# Altium project SAM_Dispenser.PrjPcb
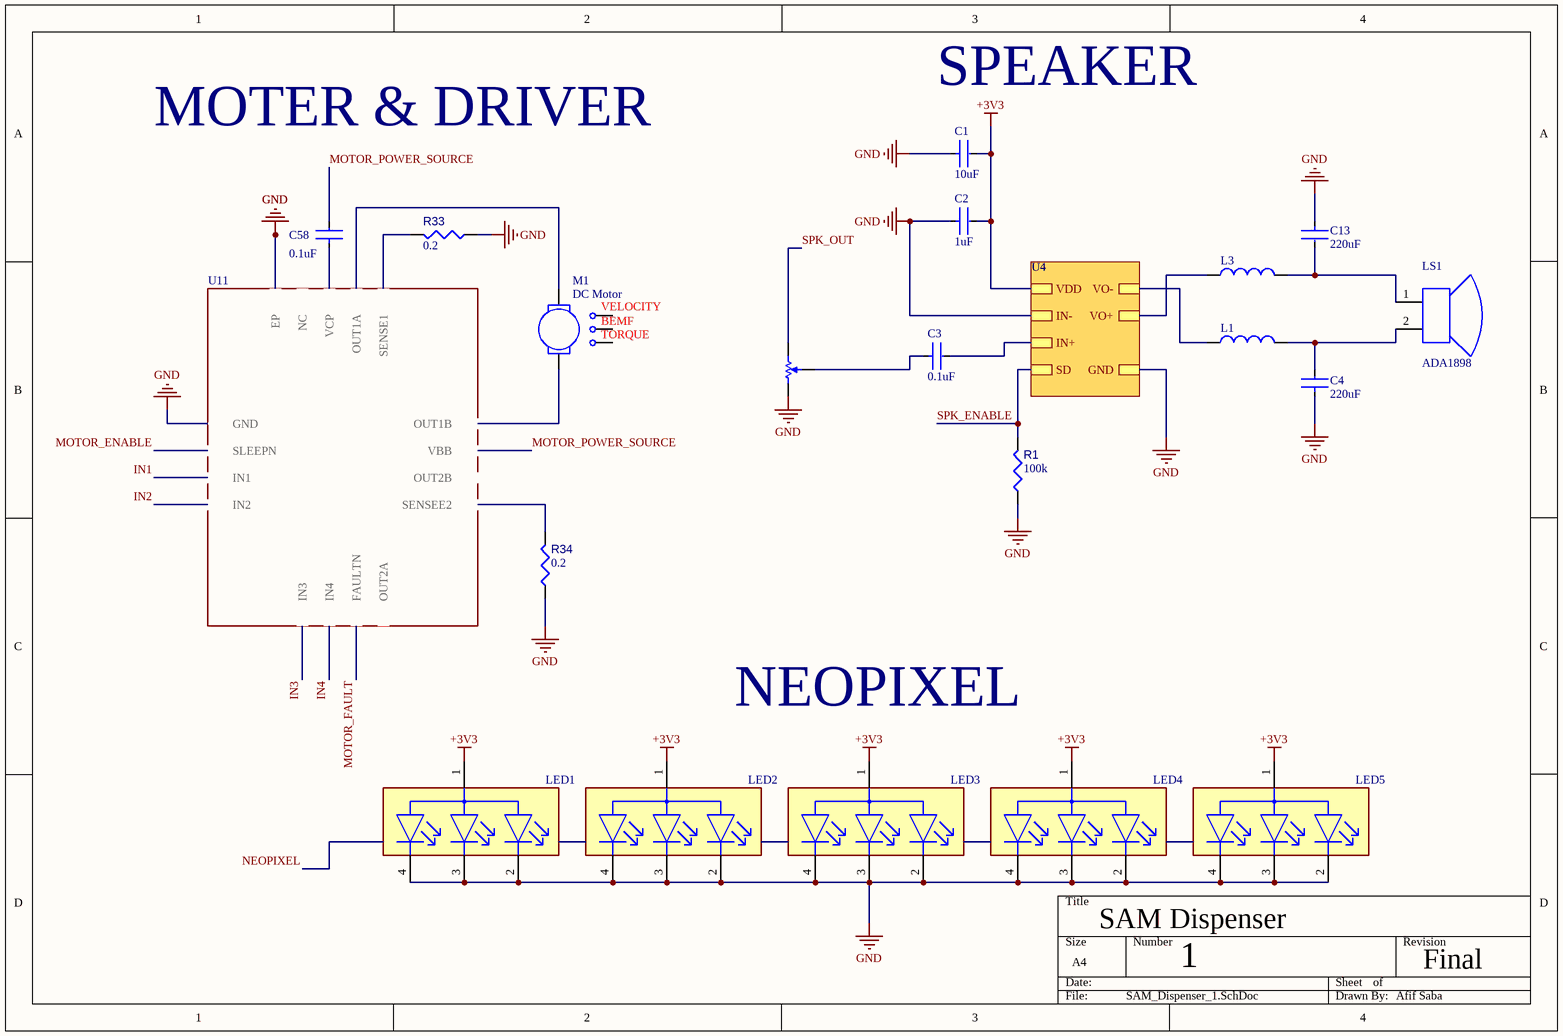
[diagram p0: SAM_Dispenser_1.SchDoc]
2 sheets, 30 parts. Net scope: hierarchical (ports join the sheet entries above them; power ports are global).
Sheets:
  SAM_Dispenser_1.SchDoc
  SAM_Dispenser_2.SchDoc

## Sheet SAM_Dispenser_1.SchDoc
size A4; SheetNumber: 1; SheetTotal: 2

### Parts
C1  Parameter 1: 10uF  [4.7uF400V]  (hidden comment: 475CKE400M)
C2  Parameter 1: 1uF  [4.7uF400V]  (hidden comment: 475CKE400M)
C3  Parameter 1: 0.1uF  [4.7uF400V]  (hidden comment: 475CKE400M)
C4  Parameter 1: 220uF  [4.7uF400V]  (hidden comment: 475CKE400M)
C13  Parameter 1: 220uF  [4.7uF400V]  (hidden comment: 475CKE400M)
C58  Parameter 1: 0.1uF  [4.7uF400V]  (hidden comment: 475CKE400M)
L1  Inductor47pH  [WE-PD 1050]  (value not drawn)
L3  Inductor47pH  [WE-PD 1050]  (value not drawn)
LED1  SML-LX0404SIUPGUSB  [FP-SML-LX0404SIUPGUSB-MFG]  (value not drawn)
LED2  SML-LX0404SIUPGUSB  [FP-SML-LX0404SIUPGUSB-MFG]  (value not drawn)
LED3  SML-LX0404SIUPGUSB  [FP-SML-LX0404SIUPGUSB-MFG]  (value not drawn)
LED4  SML-LX0404SIUPGUSB  [FP-SML-LX0404SIUPGUSB-MFG]  (value not drawn)
LED5  SML-LX0404SIUPGUSB  [FP-SML-LX0404SIUPGUSB-MFG]  (value not drawn)
LS1  ADA1898  [ADAI-ADA1898]
M1  DC Motor
R1  value 100k  [RESC0402(1005)_L]  (hidden comment: 3KR2F)
R2  TC33X-2-103E  [BOUR-TC33X-2_V]  (value not drawn)
R33  R34: 0.2  [RESC0402(1005)_L]  (hidden comment: 3KR2F)
R34  R34: 0.2  [RESC0402(1005)_L]  (hidden comment: 3KR2F)

### Sub-sheets
U11 = File Name (file not in this document): GND (bidir), SLEEPN, IN1, IN2, OUT1B, VBB, OUT2B, SENSEE2, IN3, IN4, FAULTN, OUT2A, EP, NC, VCP, OUT1A, SENSE1
? = U4 (file not in this document): VDD, VO-, VO+, IN-, IN+, SD, GND

### Nets
+3V3: C1.2 C2.2 LED1.1(Common_Anode) LED2.1(Common_Anode) LED3.1(Common_Anode) LED4.1(Common_Anode) LED5.1(Common_Anode) ; sheet /VDD
GND: C1.1 C2.1 C4.1 C13.1 LED1.2(Red_C) LED1.3(Blue_C) LED1.4(Green_C) LED2.2(Red_C) LED2.3(Blue_C) LED2.4(Green_C) LED3.2(Red_C) LED3.3(Blue_C) LED3.4(Green_C) LED4.2(Red_C) LED4.3(Blue_C) LED4.4(Green_C) LED5.2(Red_C) LED5.3(Blue_C) LED5.4(Green_C) R1.1 R2.1 R33.1 R34.1 ; sheet /IN-, sheet /GND, sheet U11/GND, sheet U11/EP
IN1: sheet U11/IN1
IN2: sheet U11/IN2
IN3: sheet U11/IN3
IN4: sheet U11/IN4
MOTOR_ENABLE: sheet U11/SLEEPN
MOTOR_FAULT: sheet U11/FAULTN
MOTOR_POWER_SOURCE: C58.2 ; sheet U11/VBB
SPK_ENABLE: R1.2 ; sheet /SD
SPK_OUT: R2.3
NetC3_1: C3.1 R2.2
NetC3_2: C3.2 ; sheet /IN+
NetC4_2: C4.2 L1.2 LS1.2(-)
NetC13_2: C13.2 L3.2 LS1.1(+)
NetC58_1: C58.1 ; sheet U11/VCP
NetL1_1: L1.1 ; sheet /VO-
NetL3_1: L3.1 ; sheet /VO+
NetM1_1: M1.1 ; sheet U11/OUT1A
NetM1_2: M1.2 ; sheet U11/OUT1B
NetR33_2: R33.2 ; sheet U11/SENSE1
NetR34_2: R34.2 ; sheet U11/SENSEE2

Not connected (* = marked no-connect by the designer): M1 3 4 5

### Notes on the sheet
- SPEAKER
- MOTER & DRIVER
- NEOPIXEL
- SAM Dispenser
- 1
- Final
- Afif Saba
- (in symbol DC Motor) VELOCITY; BEMF; TORQUE

### Library data of the parts
C1-C4 C13 C58 = CMP-003-000022-1: 4.7 µF 400 V Aluminum Electrolytic Capacitors Radial, Can 70.547Ohm @ 120Hz 2000 Hrs @ 105°C; Parameter 2: 00V; Source: NewVoltageReg.SCHLIB; Design Item ID: 475CKE400M
L1 L3 = CMP-004-000001-1: Value: 47 uH; Design Item ID: Inductor47pH; Source: VoltageSchematic.SCHLIB
LED1-LED5 = CMP-2000-07119-2: LED RGB CLEAR SMD; Test Current: 2mA; Wavelength: 465nm; Color: Blue; Lens Style: Square; Power Rating: 30mW; Lens Color: Colorless; Number of LEDs: 3; Viewing Angle: 120°; Luminous Intensity: 20mcd; Forward Voltage: 2.73V; Height: 0.3mm; Lead Free: Lead Free; Max Operating Temperature: 85°C; Mount: Surface Mount; REACH SVHC: No SVHC; Case Code (Imperial): 0404; Forward Current: 2mA; Case Code (Metric): 1010; Lens Transparency: Clear; Length: 1mm; Packaging: Tape and Reel; Min Operating Temperature: -40°C; Package Quantity: 2000; Case/Package: 0404; Width: 1mm
LS1 = CMP-00027-00000-1: Mini Speaker, 8 Ohm, 0.2 Wmax, -10 to 40 degC, 2-Pin THD, RoHS; Manufacturer: Adafruit Industries; Mounting Technology: TH; Datasheet URL: https://cdn-shop.adafruit.com/datasheets/P1898.pdf; Package Description: 2-Pin Through Hole Device, Dia 29.3 mm, Pitch 15 mm; Case/Package: ADA1898; Package Reference: ADA1898; Datasheet Version: Mar-14; Manufacturer URL: https://www.adafruit.com/; RoHS Compliant: Unknown
M1 = DC Motor: LA: 1.5M; RA: 0.5; KE: 0.05; JM: 250U; BM: 0.1M; TL: 0; SimulationGenericComponent: True; KT: 0.05
R1 R33 R34 = CMP-009-00099-1: 3K 0.063W 1% 0402 (1005 Metric)  SMD; Power: 63mW; Tolerance: 1%; Pins: 2; Case/Package: 0402; Mounting Technology: SMT
R2 = CMP-009-00060-1: Trimming Potentiometer, 10000 Ohm, -40 to 100 degC, 3-Pin SMD, RoHS, Tape and Reel; Manufacturer: Bourns; Power: 100mW; Tolerance: 25%; Resistance: 10k; Package Description: 3-Pin Surface Mount Device, Body 3.8 x 3.6 mm; Case/Package: TC33X-2; Datasheet Version: Aug-16; Manufacturer URL: http://www.bourns.com/; Min Operating Temperature: -40°C; Datasheet URL: http://www.bourns.com/docs/Product-Datasheets/TC33.pdf; Package Reference: TC33X-2; Packaging: TapeandReel; Composition: Potentiometer; Package Quantity: 2500; Max Operating Temperature: 120°C; RoHS Compliant: True; Mounting Technology: SM

## Sheet SAM_Dispenser_2.SchDoc
size A4; SheetNumber: 2; SheetTotal: 2
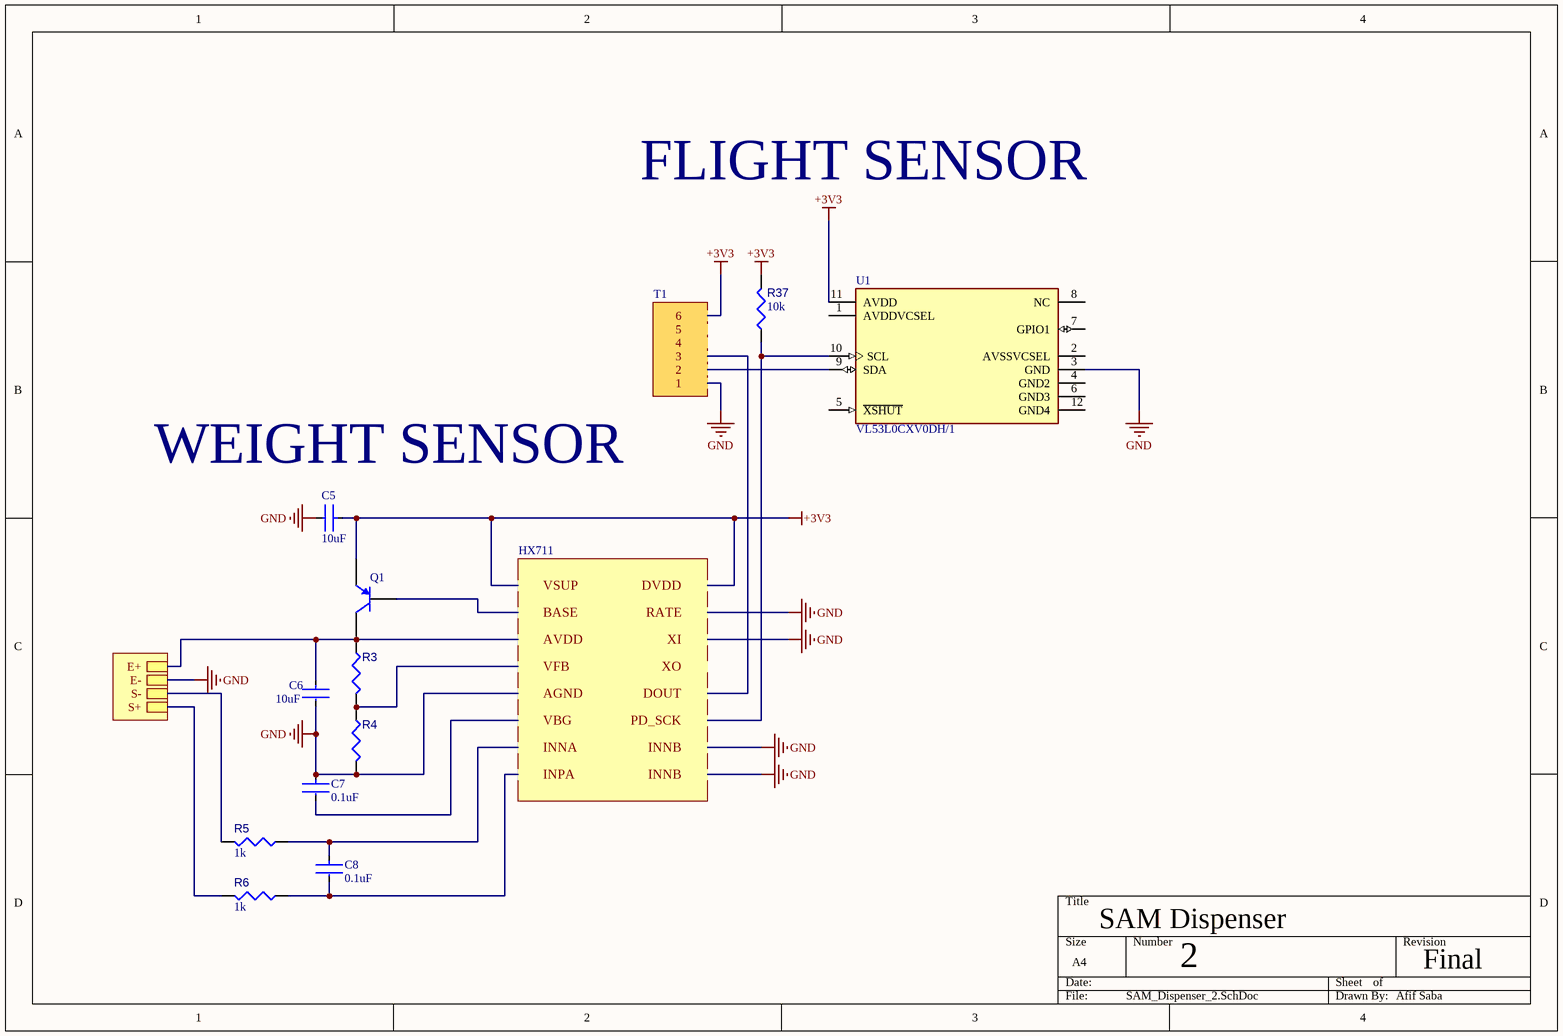
[diagram p1: SAM_Dispenser_2.SchDoc]

### Parts
C5  Parameter 1: 10uF  [4.7uF400V]  (hidden comment: 475CKE400M)
C6  Parameter 1: 10uF  [4.7uF400V]  (hidden comment: 475CKE400M)
C7  Parameter 1: 0.1uF  [4.7uF400V]  (hidden comment: 475CKE400M)
C8  Parameter 1: 0.1uF  [4.7uF400V]  (hidden comment: 475CKE400M)
Q1  PN2907ABU  [FAIR-TO-92]  (value not drawn)
R3  3KR2F  [RESC0402(1005)_L]  (value not drawn)
R4  3KR2F  [RESC0402(1005)_L]  (value not drawn)
R5  R34: 1k  [RESC0402(1005)_L]  (hidden comment: 3KR2F)
R6  R34: 1k  [RESC0402(1005)_L]  (hidden comment: 3KR2F)
R37  R34: 10k  [RESC0402(1005)_L]  (hidden comment: 3KR2F)
U1  VL53L0CXV0DH/1  [FP-LGA-12-MFG]

### Sub-sheets
Designator = HX711 (file not in this document): VSUP, BASE, AVDD, VFB, AGND, VBG, INNA, INPA, DVDD, RATE, XI, XO, DOUT, PD_SCK, INNB, INNB
Designator = File Name (file not in this document): E+, E-, S-, S+
T1 = File Name (file not in this document): 1, 2, 3, 4, 5, 6

### Nets
+3V3: C5.1 Q1.1(E) R37.2 U1.11(AVDD) ; sheet T1/6, sheet Designator/VSUP, sheet Designator/DVDD
GND: C5.2 C6.2 C7.1 R4.2 U1.3(GND) ; sheet T1/1, sheet Designator/AGND, sheet Designator/RATE, sheet Designator/XI, sheet Designator/INNB, sheet Designator/INNB, sheet Designator/E-
NetC6_1: C6.1 Q1.3(C) R3.1 ; sheet Designator/AVDD, sheet Designator/E+
NetC7_2: C7.2 ; sheet Designator/VBG
NetC8_1: C8.1 R5.1 ; sheet Designator/INNA
NetC8_2: C8.2 R6.1 ; sheet Designator/INPA
NetQ1_2: Q1.2(B) ; sheet Designator/BASE
NetR3_2: R3.2 R4.1 ; sheet Designator/VFB
NetR5_2: R5.2 ; sheet Designator/S-
NetR6_2: R6.2 ; sheet Designator/S+
NetR37_1: R37.1 U1.10(SCL) ; sheet Designator/PD_SCK
NetU1_9: U1.9(SDA) ; sheet T1/2
(unnamed): sheet T1/3, sheet Designator/DOUT

Not connected (* = marked no-connect by the designer): U1 1(AVDDVCSEL) 2(AVSSVCSEL) 4(GND2) 5(~{XSHUT}) 6(GND3) 7(GPIO1) 8(NC) 12(GND4)

### Notes on the sheet
- FLIGHT SENSOR
- (near C5) WEIGHT SENSOR
- SAM Dispenser
- 2
- Final
- Afif Saba

### Library data of the parts
C5-C8 = CMP-003-000022-1: as C1 on sheet SAM_Dispenser_1; Source: NewVoltageReg.SCHLIB; Design Item ID: 475CKE400M
Q1 = CMP-013-00010-2: BJT PNP General Purpose Transistor, 60 V, 800 mA, -55 to 150 degC, 3-Pin TO-92, RoHS, Bulk; Manufacturer: Fairchild Semiconductor; Vce Max: 1.6V; hFE Min: 100; Elements: 1; Frequency: 200MHz; Power: 625mW; Package Reference: TO-92; Package Quantity: 1000; Packaging: Bulk; Min Operating Temperature: -55°C; Pins: 3; RoHS Compliant: True; Datasheet Version: Rev. 1.1.2, 01/2014; Datasheet URL: http://datasheet.octopart.com/PN2907ABU-Fairchild-Semiconductor-datasheet-22973435.pdf; Max Operating Temperature: 150°C; Package Description: 3-Pin Transistor Outline Package, Body Dia 4.79 mm, Pitch 1.27 mm; Mounting Technology: TH; Case/Package: TO-226-3
R3 R4 = CMP-009-00099-1: 3K 0.063W 1% 0402 (1005 Metric)  SMD; Power: 63mW; R34: 1k; Tolerance: 1%; Pins: 2; Case/Package: 0402; Mounting Technology: SMT
R5 R6 R37 = CMP-009-00099-1: as R1 on sheet SAM_Dispenser_1; Tolerance: 1%; Pins: 2; Case/Package: 0402; Mounting Technology: SMT
U1 = CMP-2000-07484-2: SENSOR OPTICAL 200CM I2C; Manufacturer: STMicroelectronics; Operating Supply Current: 0.016-19mA; Max Supply Voltage: 3.5V; Min Supply Voltage: 1.6V; Height: 1.05mm; Package: LGA-12; Digikey Description: SENSOR OPTICAL 200CM I2C; Device Class L1: Sensors; Device Class L2: Optical Sensors; Temperature Range High: +70°C; Sensor Output: I2C; ComponentLink2URL: https://www.st.com/resource/en/datasheet/vl53l0x.pdf; RoHS: TRUE; Temperature: -20°C to +70°C; Device Class L3: unset; Lead Free: Yes; Temperature Range Low: -20°C; Category: IC; Manufacturer Part Number: VL53L0CXV0DH/1; ComponentLink2Description: Datasheet; Octopart: https://octopart.com/vl53l0cxv0dh%2F1-stmicroelectronics-71168165; Automotive: No

## Nets that join several sheets
+3V3: SAM_Dispenser_1 (7 pins), SAM_Dispenser_2 (C5.1 Q1.1 R37.2 U1.11)
GND: SAM_Dispenser_1 (23 pins), SAM_Dispenser_2 (5 pins)